# EAGLE schematic FM Project (EAGLE 7.5.0)
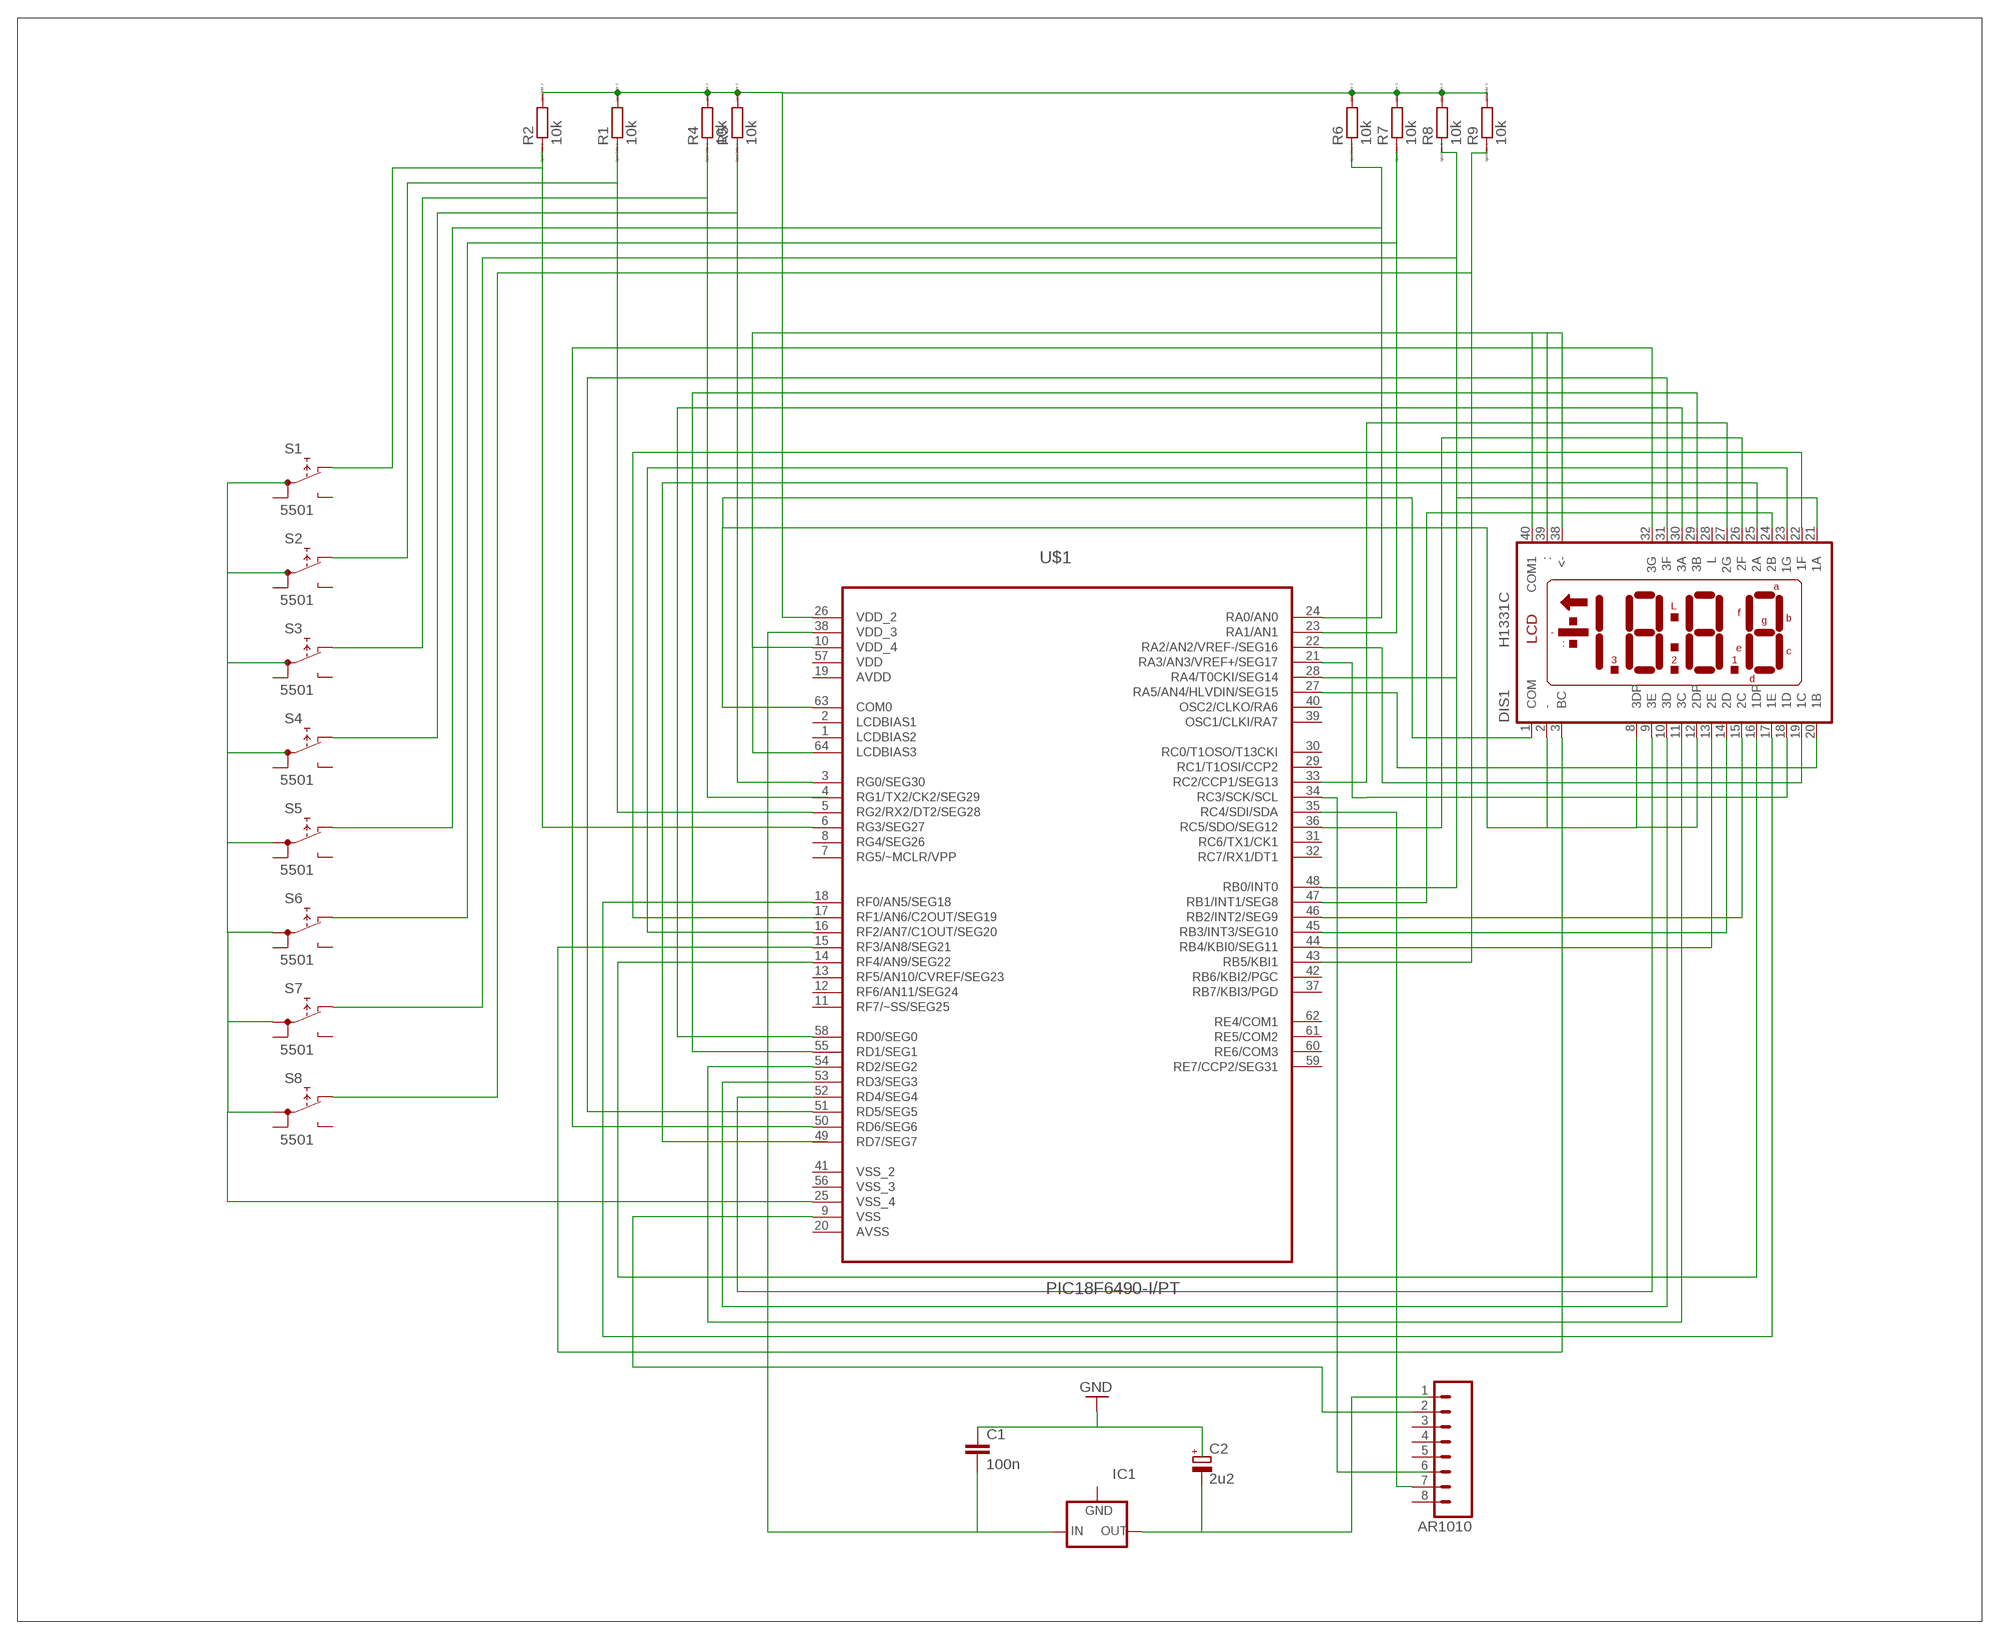
[diagram p0: schematic, sheet 1]

## Parts
AR1010  M08  [08P]
C1  100n  C5/3  [C5B3]
C2  2u2  CPOL-EU140CLH-0810  [140CLH-0810]
DIS1  H1331C  [H1331C]
IC1  79LXX  [79LXX]
R1  10k  RR0201  [R0201]
R2  10k  RR0201  [R0201]
R4  10k  RR0201  [R0201]
R5  10k  RR0201  [R0201]
R6  10k  RR0201  [R0201]
R7  10k  RR0201  [R0201]
R8  10k  RR0201  [R0201]
R9  10k  RR0201  [R0201]
S1  5501  [5501]
S2  5501  [5501]
S3  5501  [5501]
S4  5501  [5501]
S5  5501  [5501]
S6  5501  [5501]
S7  5501  [5501]
S8  5501  [5501]
U$1  PIC18F6490-I/PT  [QFP50P1200X1200X120-64N]

## Nets
GND: C1.1
N$1: DIS1.1(COM) DIS1.2(-) DIS1.8(3DP) DIS1.12(2DP) U$1.63(COM0)
N$2: DIS1.38(<-) DIS1.39(:) DIS1.40(COM1) U$1.10(VDD_4) U$1.64(LCDBIAS3)
N$3: DIS1.21(1A) U$1.28(RA4/T0CKI/SEG14)
N$4: DIS1.20(1B) U$1.27(RA5/AN4/HLVDIN/SEG15)
N$5: DIS1.19(1C) U$1.22(RA2/AN2/VREF-/SEG16)
N$6: DIS1.27(2G) U$1.33(RC2/CCP1/SEG13)
N$7: DIS1.17(1E) U$1.18(RF0/AN5/SEG18)
N$8: DIS1.22(1F) U$1.17(RF1/AN6/C2OUT/SEG19)
N$9: DIS1.23(1G) U$1.16(RF2/AN7/C1OUT/SEG20)
N$10: DIS1.18(1D) U$1.21(RA3/AN3/VREF+/SEG17)
N$11: DIS1.25(2A)
N$12: DIS1.24(2B) U$1.47(RB1/INT1/SEG8)
N$13: DIS1.15(2C) U$1.46(RB2/INT2/SEG9)
N$14: DIS1.14(2D) U$1.45(RB3/INT3/SEG10)
N$15: DIS1.13(2E) U$1.44(RB4/KBI0/SEG11)
N$16: DIS1.26(2F) U$1.36(RC5/SDO/SEG12)
N$17: DIS1.30(3A) U$1.58(RD0/SEG0)
N$18: DIS1.29(3B) U$1.55(RD1/SEG1)
N$19: DIS1.11(3C) U$1.54(RD2/SEG2)
N$20: DIS1.10(3D) U$1.53(RD3/SEG3)
N$21: DIS1.9(3E) U$1.52(RD4/SEG4)
N$22: DIS1.31(3F) U$1.51(RD5/SEG5)
N$23: DIS1.32(3G) U$1.50(RD6/SEG6)
N$24: DIS1.16(1DP) U$1.14(RF4/AN9/SEG22)
N$25: DIS1.3(BC) U$1.15(RF3/AN8/SEG21)
N$26: C1.2 IC1.IN U$1.38(VDD_3)
N$27: IC1.OUT
N$28: AR1010.7 U$1.35(RC4/SDI/SDA)
N$29: R9.1 U$1.43(RB5/KBI1)
N$31: AR1010.2 U$1.9(VSS)
N$32: R8.1 U$1.48(RB0/INT0)
N$33: R6.1 U$1.24(RA0/AN0)
N$34: U$1.23(RA1/AN1)
N$35: U$1.3(RG0/SEG30)
N$36: R4.1
N$37: R1.1 U$1.5(RG2/RX2/DT2/SEG28)
N$38: R2.1 U$1.6(RG3/SEG27)
N$39: R1.2 R2.2 R4.2 R5.2 R6.2 R7.2 R8.2 R9.2 U$1.26(VDD_2)
N$40: S1.NC
N$41: S2.NC
N$42: S3.NC
N$43: S4.NC
N$44: S5.NC
N$45: S6.NC
N$46: S7.NC
N$47: S8.NC
N$48: S5.1A S6.1A S7.1A S8.1A U$1.25(VSS_4)
N$49: U$1.34(RC3/SCK/SCL)
Unconnected: AR1010.1 AR1010.3 AR1010.4 AR1010.5 AR1010.6 AR1010.8 C2.+ C2.- DIS1.28(L) IC1.GND R5.1 R7.1 S1.1A S1.1B S1.NO S2.1A S2.1B S2.NO S3.1A S3.1B S3.NO S4.1A S4.1B S4.NO S5.1B S5.NO S6.1B S6.NO S7.1B S7.NO S8.1B S8.NO U$1.1(LCDBIAS2) U$1.2(LCDBIAS1) U$1.4(RG1/TX2/CK2/SEG29) U$1.7(RG5/~MCLR/VPP) U$1.8(RG4/SEG26) U$1.11(RF7/~SS/SEG25) U$1.12(RF6/AN11/SEG24) U$1.13(RF5/AN10/CVREF/SEG23) U$1.29(RC1/T1OSI/CCP2) U$1.30(RC0/T1OSO/T13CKI) U$1.31(RC6/TX1/CK1) U$1.32(RC7/RX1/DT1) U$1.37(RB7/KBI3/PGD) U$1.39(OSC1/CLKI/RA7) U$1.40(OSC2/CLKO/RA6) U$1.42(RB6/KBI2/PGC) U$1.49(RD7/SEG7) U$1.59(RE7/CCP2/SEG31) U$1.60(RE6/COM3) U$1.61(RE5/COM2) U$1.62(RE4/COM1)

## Power pins joined to a net without a drawn wire
AVDD: U$1.19(AVDD)
AVSS: U$1.20(AVSS)
VDD: U$1.57(VDD)
VSS_2: U$1.41(VSS_2)
VSS_3: U$1.56(VSS_3)

## Library data of the parts
AR1010 = con-amp-quick:M08: AMP QUICK CONNECTOR; OC_FARNELL: unknown; OC_NEWARK: unknown
C1 = capacitor-wima:C: CAPACITOR naming: grid - package width
C2 = resistor:CPOL-EU: POLARIZED CAPACITOR, European symbol
DIS1 = display-lcd:H1331C: LCD DISPLAY 3 1/2 character 7 segment; OC_FARNELL: unknown; OC_NEWARK: unknown
IC1 = v-reg:79LXX: VOLTAGE REGULATOR
R1 R2 R4-R9 = eagle-ltspice:R: RESISTOR, European symbol; SPICEMODEL: NONE; SPICEPREFIX: R
S1-S8 = switch:55?: PUSHBUTTON SERIES 5500 SWITCHES Source: www.e-switch.com .. 5500.pdf
U$1 = Microchip_By_element14_Batch_1:PIC18F6490-I/PT: IC PIC MCU; MPN: PIC18F6490-I/PT; OC_FARNELL: 1332278; OC_NEWARK: 08J9646; PACKAGE: QFP-64; SUPPLIER: Microchip